# Altium schematic sheet 06_LED_ARRAY.SchDoc
size A; SheetNumber: 6; SheetTotal: 6
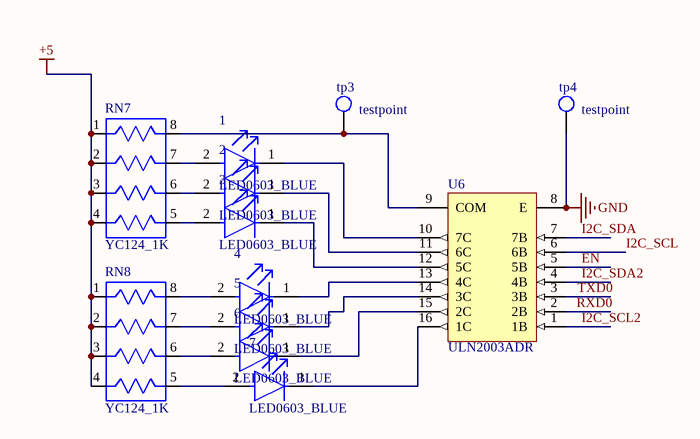
[diagram p0: 06_LED_ARRAY.SchDoc]

## Parts
1  LED0603_BLUE  [FP-LTST-C191TBKT-MFG]
2  LED0603_BLUE  [FP-LTST-C191TBKT-MFG]
3  LED0603_BLUE  [FP-LTST-C191TBKT-MFG]
4  LED0603_BLUE  [FP-LTST-C191TBKT-MFG]
5  LED0603_BLUE  [FP-LTST-C191TBKT-MFG]
6  LED0603_BLUE  [FP-LTST-C191TBKT-MFG]
7  LED0603_BLUE  [FP-LTST-C191TBKT-MFG]
RN7  YC124_1K  [YC124]
RN8  YC124_1K  [YC124]
tp3  testpoint  [testpoint_1mm]
tp4  testpoint  [testpoint_1mm]
U6  ULN2003ADR  [D0016A_M]

## Nets
+5: RN7.1 RN7.2 RN7.3 RN7.4 RN8.1 RN8.2 RN8.3 RN8.4
GND: tp4.1 U6.8(E)
EN: U6.5(5B)
I2C_SCL: U6.6(6B)
I2C_SCL2: U6.1(1B)
I2C_SDA: U6.7(7B)
I2C_SDA2: U6.4(4B)
RXD0: U6.2(2B)
TXD0: U6.3(3B)
Net1_1: 1.1(C) U6.10(7C)
Net1_2: 1.2(A) RN7.7
Net2_1: 2.1(C) U6.11(6C)
Net2_2: 2.2(A) RN7.6
Net3_1: 3.1(C) U6.12(5C)
Net3_2: 3.2(A) RN7.5
Net4_1: 4.1(C) U6.13(4C)
Net4_2: 4.2(A) RN8.8
Net5_1: 5.1(C) U6.14(3C)
Net5_2: 5.2(A) RN8.7
Net6_1: 6.1(C) U6.15(2C)
Net6_2: 6.2(A) RN8.6
Net7_1: 7.1(C) U6.16(1C)
Net7_2: 7.2(A) RN8.5
NetRN7_8: RN7.8 tp3.1 U6.9(COM)

## Library data of the parts
1-7 = CMP-22017-000008-1: LED BLUE CLEAR CHIP SMD; Lens Color: Colorless; Dominant Wavelength: 475nm; Forward Current: 20mA; Wavelength: 468nm; Viewing Angle: 130°; Power Dissipation: 76mW; Luminous Intensity: 180mcd; Reverse Voltage: 5V; Number of Elements: 1; Lens Style: Diffused; Forward Voltage: 3.8V; Max Power Dissipation: 75mW; Case Code (Metric): 1608; Packaging: Tape and Reel; Case/Package: 0603; Depth: 1.6mm; Mount: Surface Mount; Lead Free: Lead Free; Min Operating Temperature: -20°C; Lens Transparency: Clear; Illumination Color: Blue; Height: 0.55mm; Test Current: 20mA; Case Code (Imperial): 0603; Max Operating Temperature: 80°C; Number of Pins: 2; Length: 0.8mm; Radiation Hardening: No; Package Quantity: 1; Number of LEDs: 1; Width: 0.8mm; Color: Blue
RN7 RN8 = YC124
U6 = CMP-2000-04953-1: High-Voltage, High-Current Darlington Transistor Array, 0.5 A, 50 V, -20 to 70 degC, 16-Pin SOIC (D), Green (RoHS & no Sb/Br), Tape and Reel; Manufacturer: TexasInstruments; Peak DC Collector Current: 0.5A; Package Version: 4040047-6/M, 06/2011; Maximum Collector Emitter Voltage: 50V; Configuration: Array7; Maximum Collector Emitter Saturation Voltage: 1.1@100mA; Rad Hard: No; Packaging: Tape&Reel; Datasheet URL: http://www.ti.com/general/docs/lit/getliterature.tsp?genericPartNumber=uln2003a&fileType=pdf; Package Reference: D16; Category: DarlingtonBJT; Datasheet Version: Rev. O, 01/2016; Manufacturer URL: http://www.ti.com/; Type: NPN; Package Description: 16-Pin Plastic Small Outline, Body 9.9 x 3.9 mm, Pitch 1.27 mm; Mounting: SurfaceMount; Package: 16SOIC; Package URL: http://www.ti.com/lit/ml/mpds178g/mpds178g.pdf